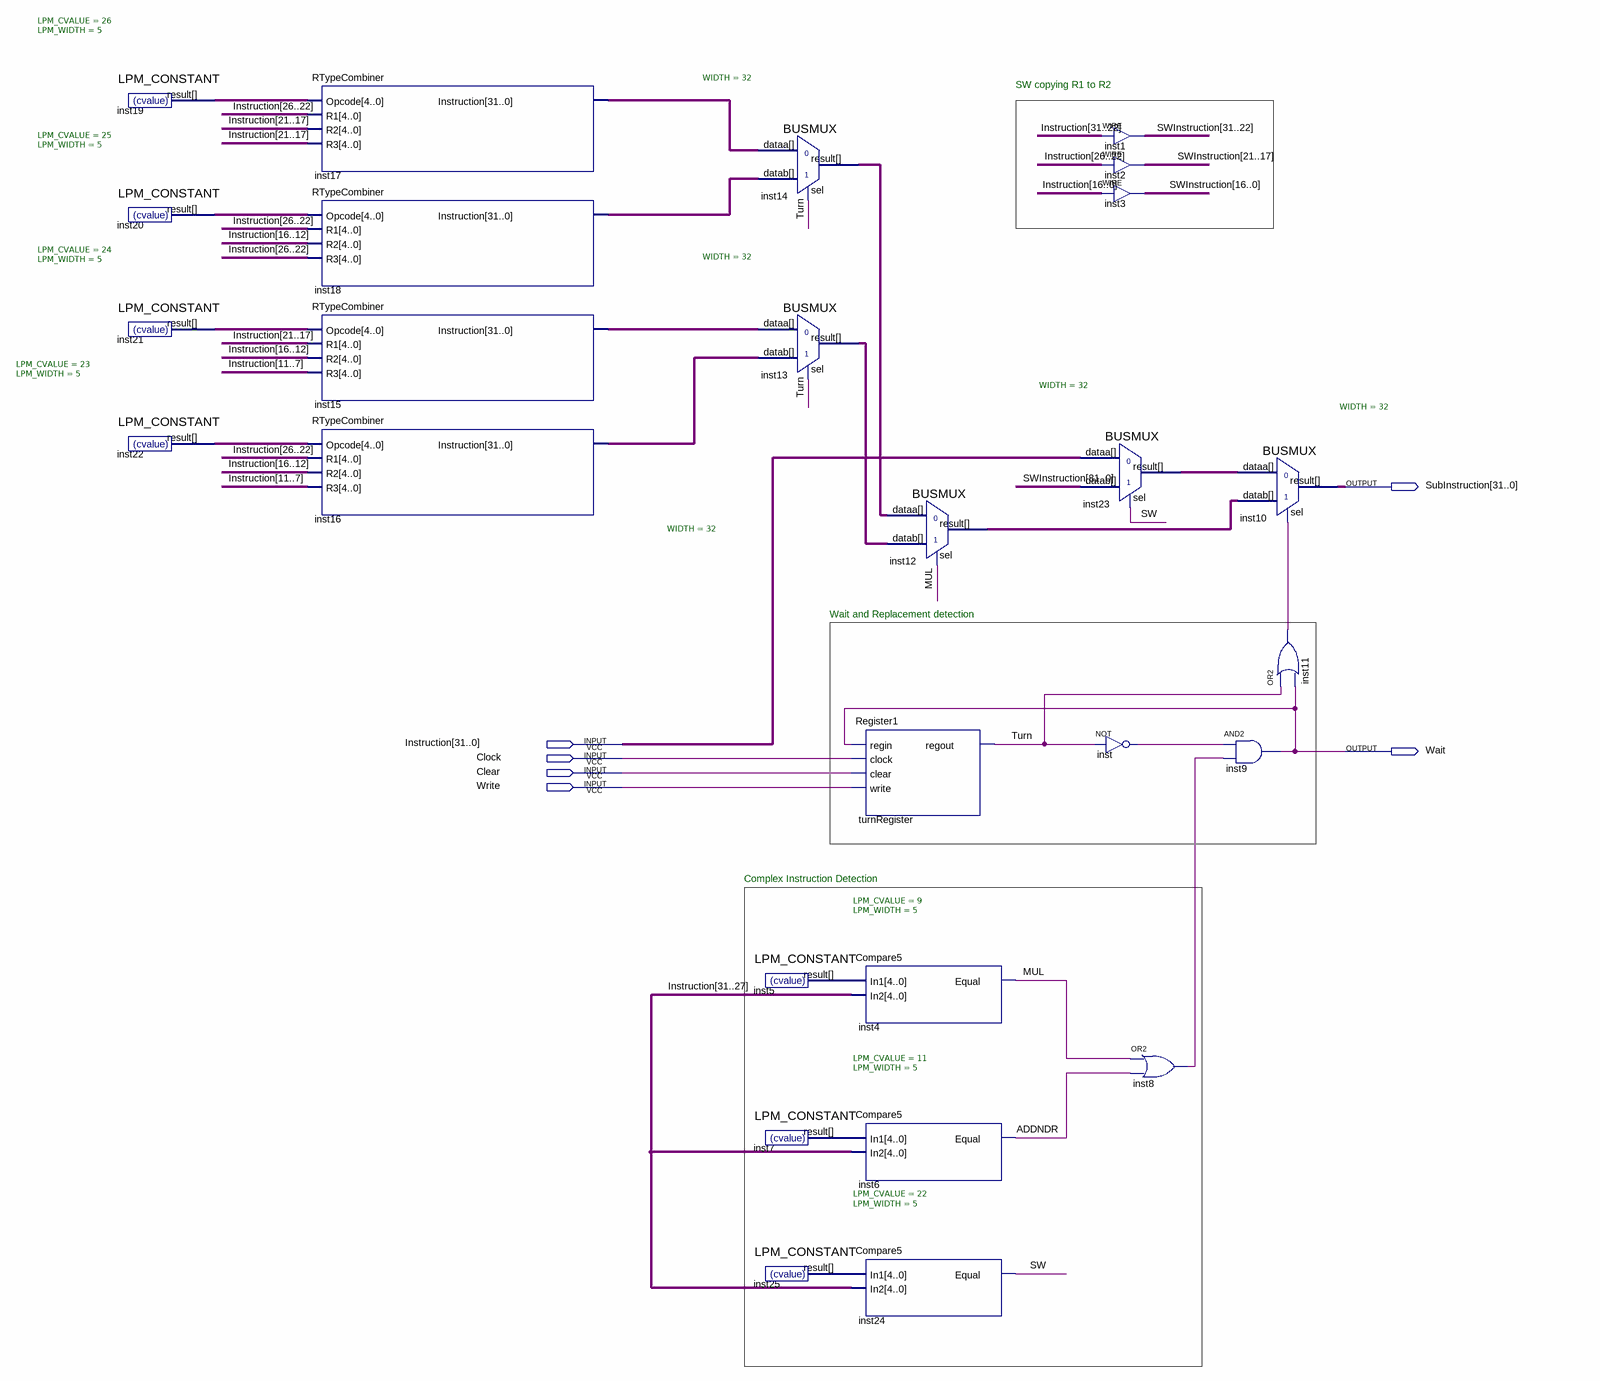
[diagram p0: schematic sheet]
// Quartus schematic Preprocessor.bdf as structural Verilog: 27 symbols, 6 pins
module Preprocessor (
  input  [31:0] Instruction,
  input  Clock,
  input  Clear,
  input  Write,
  output [31:0] SubInstruction,
  output Wait
);

  wire ADDNDR, inst8_out, inst11_out, inst_out, MUL, SW, Turn;
  wire [4:0] inst5_result, inst7_result, inst19_result, inst20_result, inst21_result, inst22_result,
       inst25_result;
  wire [31:0] inst12_result, inst13_result, inst14_result, inst15_instruction, inst16_instruction,
       inst17_instruction, inst18_instruction, inst23_result, SWInstruction;

  LPM_CONSTANT #(.LPM_CVALUE(26), .LPM_WIDTH(5)) inst19 (.result(inst19_result));
  LPM_CONSTANT #(.LPM_CVALUE(25), .LPM_WIDTH(5)) inst20 (.result(inst20_result));
  LPM_CONSTANT #(.LPM_CVALUE(24), .LPM_WIDTH(5)) inst21 (.result(inst21_result));
  LPM_CONSTANT #(.LPM_CVALUE(23), .LPM_WIDTH(5)) inst22 (.result(inst22_result));
  RTypeCombiner inst17 (
    .Opcode(inst19_result), .R1(Instruction[26:22]), .R2(Instruction[21:17]), .R3(Instruction[21:17]),
    .Instruction(inst17_instruction));
  RTypeCombiner inst18 (
    .Opcode(inst20_result), .R1(Instruction[26:22]), .R2(Instruction[16:12]), .R3(Instruction[26:22]),
    .Instruction(inst18_instruction));
  RTypeCombiner inst15 (
    .Opcode(inst21_result), .R1(Instruction[21:17]), .R2(Instruction[16:12]), .R3(Instruction[11:7]),
    .Instruction(inst15_instruction));
  RTypeCombiner inst16 (
    .Opcode(inst22_result), .R1(Instruction[26:22]), .R2(Instruction[16:12]), .R3(Instruction[11:7]),
    .Instruction(inst16_instruction));
  BUSMUX #(.WIDTH(32)) inst14 (
    .datab(inst18_instruction), .sel(Turn), .dataa(inst17_instruction), .result(inst14_result));
  BUSMUX #(.WIDTH(32)) inst13 (
    .datab(inst16_instruction), .sel(Turn), .dataa(inst15_instruction), .result(inst13_result));
  LPM_CONSTANT #(.LPM_CVALUE(9), .LPM_WIDTH(5)) inst5 (.result(inst5_result));
  LPM_CONSTANT #(.LPM_CVALUE(11), .LPM_WIDTH(5)) inst7 (.result(inst7_result));
  LPM_CONSTANT #(.LPM_CVALUE(22), .LPM_WIDTH(5)) inst25 (.result(inst25_result));
  Register1 turnRegister (.regin(Wait), .clock(Clock), .clear(Clear), .write(Write), .regout(Turn));
  Compare5 inst4 (.In1(inst5_result), .In2(Instruction[31:27]), .Equal(MUL));
  Compare5 inst6 (.In1(inst7_result), .In2(Instruction[31:27]), .Equal(ADDNDR));
  Compare5 inst24 (.In1(inst25_result), .In2(Instruction[31:27]), .Equal(SW));
  BUSMUX #(.WIDTH(32)) inst12 (.datab(inst13_result), .sel(MUL), .dataa(inst14_result), .result(inst12_result));
  assign SWInstruction[31:22] = Instruction[31:22];  // WIRE inst1
  assign SWInstruction[21:17] = Instruction[26:22];  // WIRE inst2
  assign SWInstruction[16:0] = Instruction[16:0];  // WIRE inst3
  BUSMUX #(.WIDTH(32)) inst23 (.datab(SWInstruction), .sel(SW), .dataa(Instruction), .result(inst23_result));
  not inst (inst_out, Turn);
  or inst8 (inst8_out, MUL, ADDNDR);
  BUSMUX #(.WIDTH(32)) inst10 (.datab(inst12_result), .sel(inst11_out), .dataa(inst23_result), .result(SubInstruction));
  or inst11 (inst11_out, Turn, Wait);
  and inst9 (Wait, inst_out, inst8_out);

  // Notes on the sheet:
  //   SW copying R1 to R2
  //   Wait and Replacement detection
  //   Complex Instruction Detection
endmodule
